# Altium schematic sheet XMOS_TSBOARD_PHY.SchDoc
size A3; DocumentNumber: 5; SheetNumber: 5; SheetTotal: 8
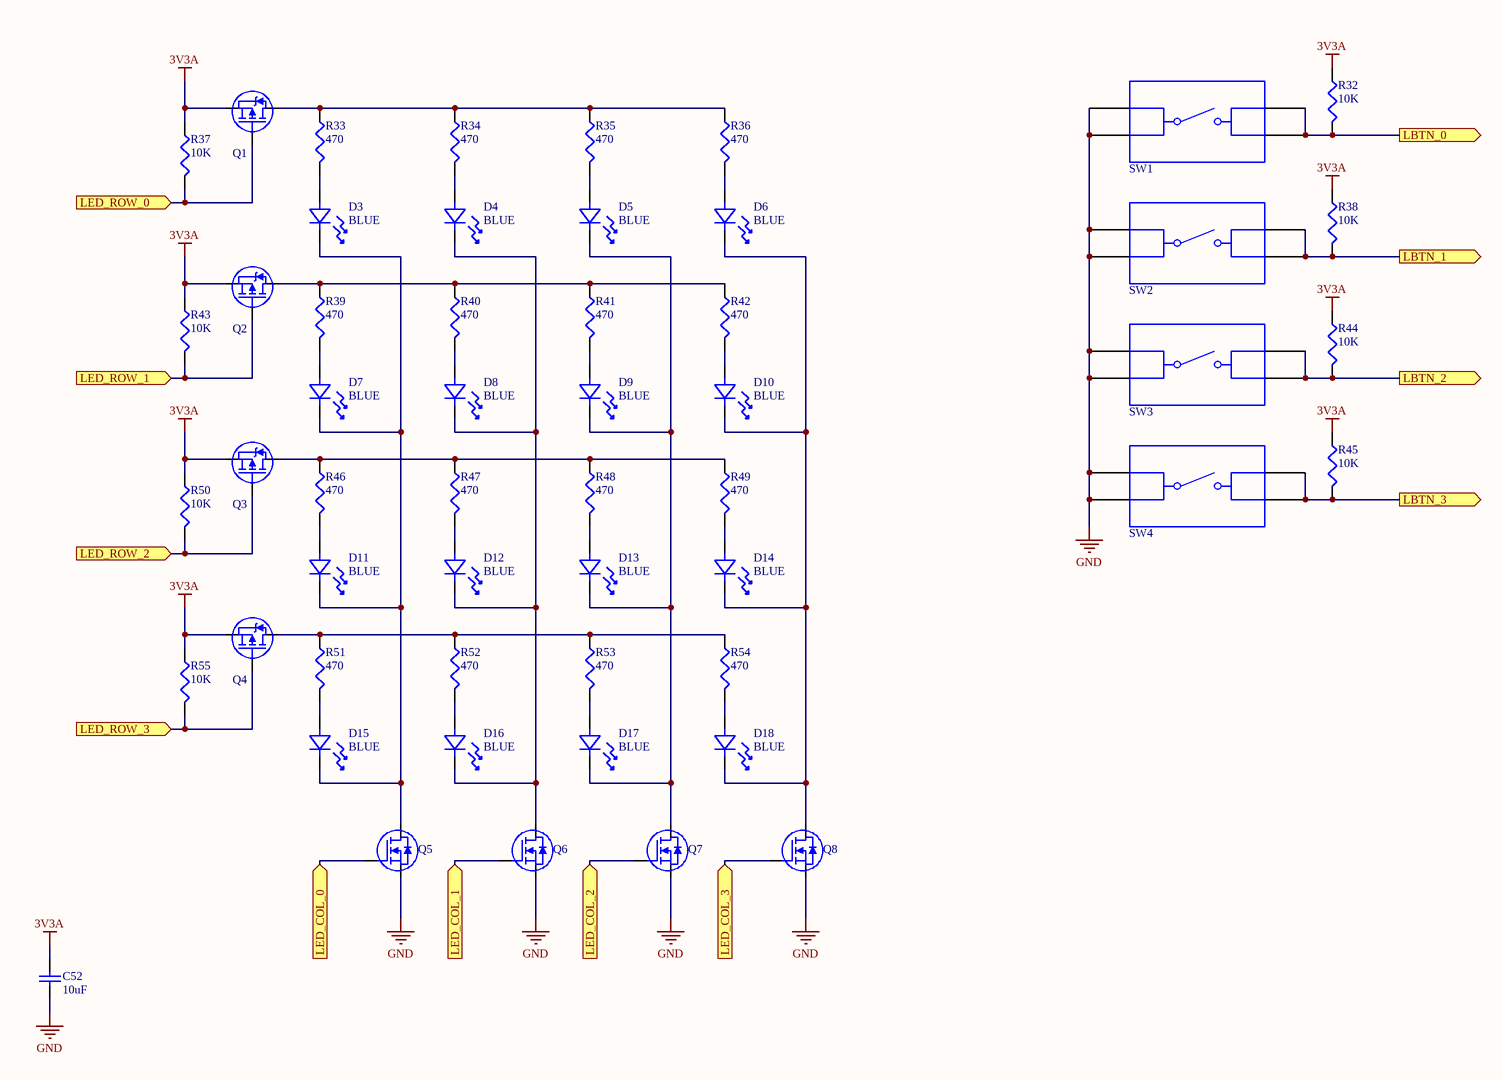
[diagram p0: XMOS_TSBOARD_PHY.SchDoc]

## Parts
C52  value 10uF  [1608[0603]]  (hidden comment: Cap Semi)
D3  BLUE  [0603_LED]
D4  BLUE  [0603_LED]
D5  BLUE  [0603_LED]
D6  BLUE  [0603_LED]
D7  BLUE  [0603_LED]
D8  BLUE  [0603_LED]
D9  BLUE  [0603_LED]
D10  BLUE  [0603_LED]
D11  BLUE  [0603_LED]
D12  BLUE  [0603_LED]
D13  BLUE  [0603_LED]
D14  BLUE  [0603_LED]
D15  BLUE  [0603_LED]
D16  BLUE  [0603_LED]
D17  BLUE  [0603_LED]
D18  BLUE  [0603_LED]
Q1  MOSFET  [SOT-23]  (value not drawn)
Q2  MOSFET  [SOT-23]  (value not drawn)
Q3  MOSFET  [SOT-23]  (value not drawn)
Q4  MOSFET  [SOT-23]  (value not drawn)
Q5  BSS138  [SOT-23]  (value not drawn)
Q6  BSS138  [SOT-23]  (value not drawn)
Q7  BSS138  [SOT-23]  (value not drawn)
Q8  BSS138  [SOT-23]  (value not drawn)
R32  value 10K  [J1-0603]  (hidden comment: Res3)
R33  value 470  [J1-0603]  (hidden comment: Res3)
R34  value 470  [J1-0603]  (hidden comment: Res3)
R35  value 470  [J1-0603]  (hidden comment: Res3)
R36  value 470  [J1-0603]  (hidden comment: Res3)
R37  value 10K  [J1-0603]  (hidden comment: Res3)
R38  value 10K  [J1-0603]  (hidden comment: Res3)
R39  value 470  [J1-0603]  (hidden comment: Res3)
R40  value 470  [J1-0603]  (hidden comment: Res3)
R41  value 470  [J1-0603]  (hidden comment: Res3)
R42  value 470  [J1-0603]  (hidden comment: Res3)
R43  value 10K  [J1-0603]  (hidden comment: Res3)
R44  value 10K  [J1-0603]  (hidden comment: Res3)
R45  value 10K  [J1-0603]  (hidden comment: Res3)
R46  value 470  [J1-0603]  (hidden comment: Res3)
R47  value 470  [J1-0603]  (hidden comment: Res3)
R48  value 470  [J1-0603]  (hidden comment: Res3)
R49  value 470  [J1-0603]  (hidden comment: Res3)
R50  value 10K  [J1-0603]  (hidden comment: Res3)
R51  value 470  [J1-0603]  (hidden comment: Res3)
R52  value 470  [J1-0603]  (hidden comment: Res3)
R53  value 470  [J1-0603]  (hidden comment: Res3)
R54  value 470  [J1-0603]  (hidden comment: Res3)
R55  value 10K  [J1-0603]  (hidden comment: Res3)
SW1  FSM6JSMA  [SW_6x6]  (value not drawn)
SW2  FSM6JSMA  [SW_6x6]  (value not drawn)
SW3  FSM6JSMA  [SW_6x6]  (value not drawn)
SW4  FSM6JSMA  [SW_6x6]  (value not drawn)

## Ports
LBTN_0 (out), LBTN_1 (out), LBTN_2 (out), LBTN_3 (out), LED_COL_0 (in), LED_COL_1 (in), LED_COL_2 (in), LED_COL_3 (in), LED_ROW_0 (in), LED_ROW_1 (in), LED_ROW_2 (in), LED_ROW_3 (in)

## Nets
3V3A: C52.2 Q1.2(S) Q2.2(S) Q3.2(S) Q4.2(S) R32.1 R37.1 R38.1 R43.1 R44.1 R45.1 R50.1 R55.1
GND: C52.1 Q5.2(S) Q6.2(S) Q7.2(S) Q8.2(S) SW1.1 SW1.2 SW2.1 SW2.2 SW3.1 SW3.2 SW4.1 SW4.2
LBTN_0: R32.2 SW1.3 SW1.4 ; port LBTN_0
LBTN_1: R38.2 SW2.3 SW2.4 ; port LBTN_1
LBTN_2: R44.2 SW3.3 SW3.4 ; port LBTN_2
LBTN_3: R45.2 SW4.3 SW4.4 ; port LBTN_3
LED_COL_0: Q5.1(G) ; port LED_COL_0
LED_COL_1: Q6.1(G) ; port LED_COL_1
LED_COL_2: Q7.1(G) ; port LED_COL_2
LED_COL_3: Q8.1(G) ; port LED_COL_3
LED_ROW_0: Q1.1(G) R37.2 ; port LED_ROW_0
LED_ROW_1: Q2.1(G) R43.2 ; port LED_ROW_1
LED_ROW_2: Q3.1(G) R50.2 ; port LED_ROW_2
LED_ROW_3: Q4.1(G) R55.2 ; port LED_ROW_3
NetD3_1: D3.1 D7.1 D11.1 D15.1 Q5.3(D)
NetD3_2: D3.2 R33.2
NetD4_1: D4.1 D8.1 D12.1 D16.1 Q6.3(D)
NetD4_2: D4.2 R34.2
NetD5_1: D5.1 D9.1 D13.1 D17.1 Q7.3(D)
NetD5_2: D5.2 R35.2
NetD6_1: D6.1 D10.1 D14.1 D18.1 Q8.3(D)
NetD6_2: D6.2 R36.2
NetD7_2: D7.2 R39.2
NetD8_2: D8.2 R40.2
NetD9_2: D9.2 R41.2
NetD10_2: D10.2 R42.2
NetD11_2: D11.2 R46.2
NetD12_2: D12.2 R47.2
NetD13_2: D13.2 R48.2
NetD14_2: D14.2 R49.2
NetD15_2: D15.2 R51.2
NetD16_2: D16.2 R52.2
NetD17_2: D17.2 R53.2
NetD18_2: D18.2 R54.2
NetQ1_3: Q1.3(D) R33.1 R34.1 R35.1 R36.1
NetQ2_3: Q2.3(D) R39.1 R40.1 R41.1 R42.1
NetQ3_3: Q3.3(D) R46.1 R47.1 R48.1 R49.1
NetQ4_3: Q4.3(D) R51.1 R52.1 R53.1 R54.1

## Library data of the parts
C52 = Cap Semi: Capacitor (Semiconductor SIM Model); Published: 8-Jun-2000; LatestRevisionDate: 29-May-2009; LatestRevisionNote: IPC-7351 Footprint Added.; PackageReference: C1206; Publisher: Altium Limited; PackageDescription: Chip Capacitor
D3-D18 = LED
Q1-Q4 = BSS84: MOSFET, P-Channel, Logic Level, 50V, 130mA, SOT23
Q5-Q8 = BSS138: MOSFET, N-Channel, Logic Level, 50V, 220mA, SOT23
R32-R55 = Res3: Resistor; Published: 8-Jun-2000; LatestRevisionDate: 29-May-2009; LatestRevisionNote: IPC-7351 Footprint Added.; PackageReference: J1-0603; Publisher: Altium Limited; PackageDescription: Chip Resistor
SW1-SW4 = FSM6JSMA: Switch Push Button N.O. SPST Round Button 0.05A 12VDC 1VA Alternate Contact Gull Wing SMD T/R